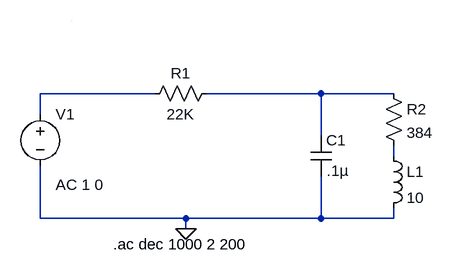
[diagram p0: schematic inductor measurement parallel.asc]
inductor measurement parallel.asc, the LTspice schematic file:
Version 4
SHEET 1 880 680
WIRE 128 112 -48 112
WIRE 384 112 208 112
WIRE 496 112 384 112
WIRE -48 144 -48 112
WIRE 384 176 384 112
WIRE 496 208 496 192
WIRE -48 304 -48 224
WIRE 176 304 -48 304
WIRE 384 304 384 240
WIRE 384 304 176 304
WIRE 496 304 496 288
WIRE 496 304 384 304
WIRE 176 320 176 304
WIRE 0 0 0 0
FLAG 176 320 0
SYMBOL voltage -48 128 R0
WINDOW 123 24 124 Left 2
WINDOW 39 0 0 Left 2
SYMATTR Value2 AC 1 0
SYMATTR InstName V1
SYMATTR Value ""
SYMBOL res 480 96 R0
SYMATTR InstName R2
SYMATTR Value 384
SYMBOL ind 480 192 R0
SYMATTR InstName L1
SYMATTR Value 10
SYMBOL cap 368 176 R0
WINDOW 3 25 55 Left 2
SYMATTR Value .1µ
SYMATTR InstName C1
SYMBOL res 112 128 R270
WINDOW 0 32 56 VTop 2
WINDOW 3 0 56 VBottom 2
SYMATTR InstName R1
SYMATTR Value 22K
TEXT 64 344 Left 2 !.ac dec 1000 2 200

The netlist it stands for:
* inductor measurement parallel.asc
V1 N001 0 AC 1 0
R2 N002 N003 384
L1 N003 0 10
C1 N002 0 .1µ
R1 N001 N002 22K
.ac dec 1000 2 200
.backanno
.end